# Altium schematic sheet Main_MCU.SchDoc
size B; DocumentNumber: 3; SheetNumber: 3; SheetTotal: 7
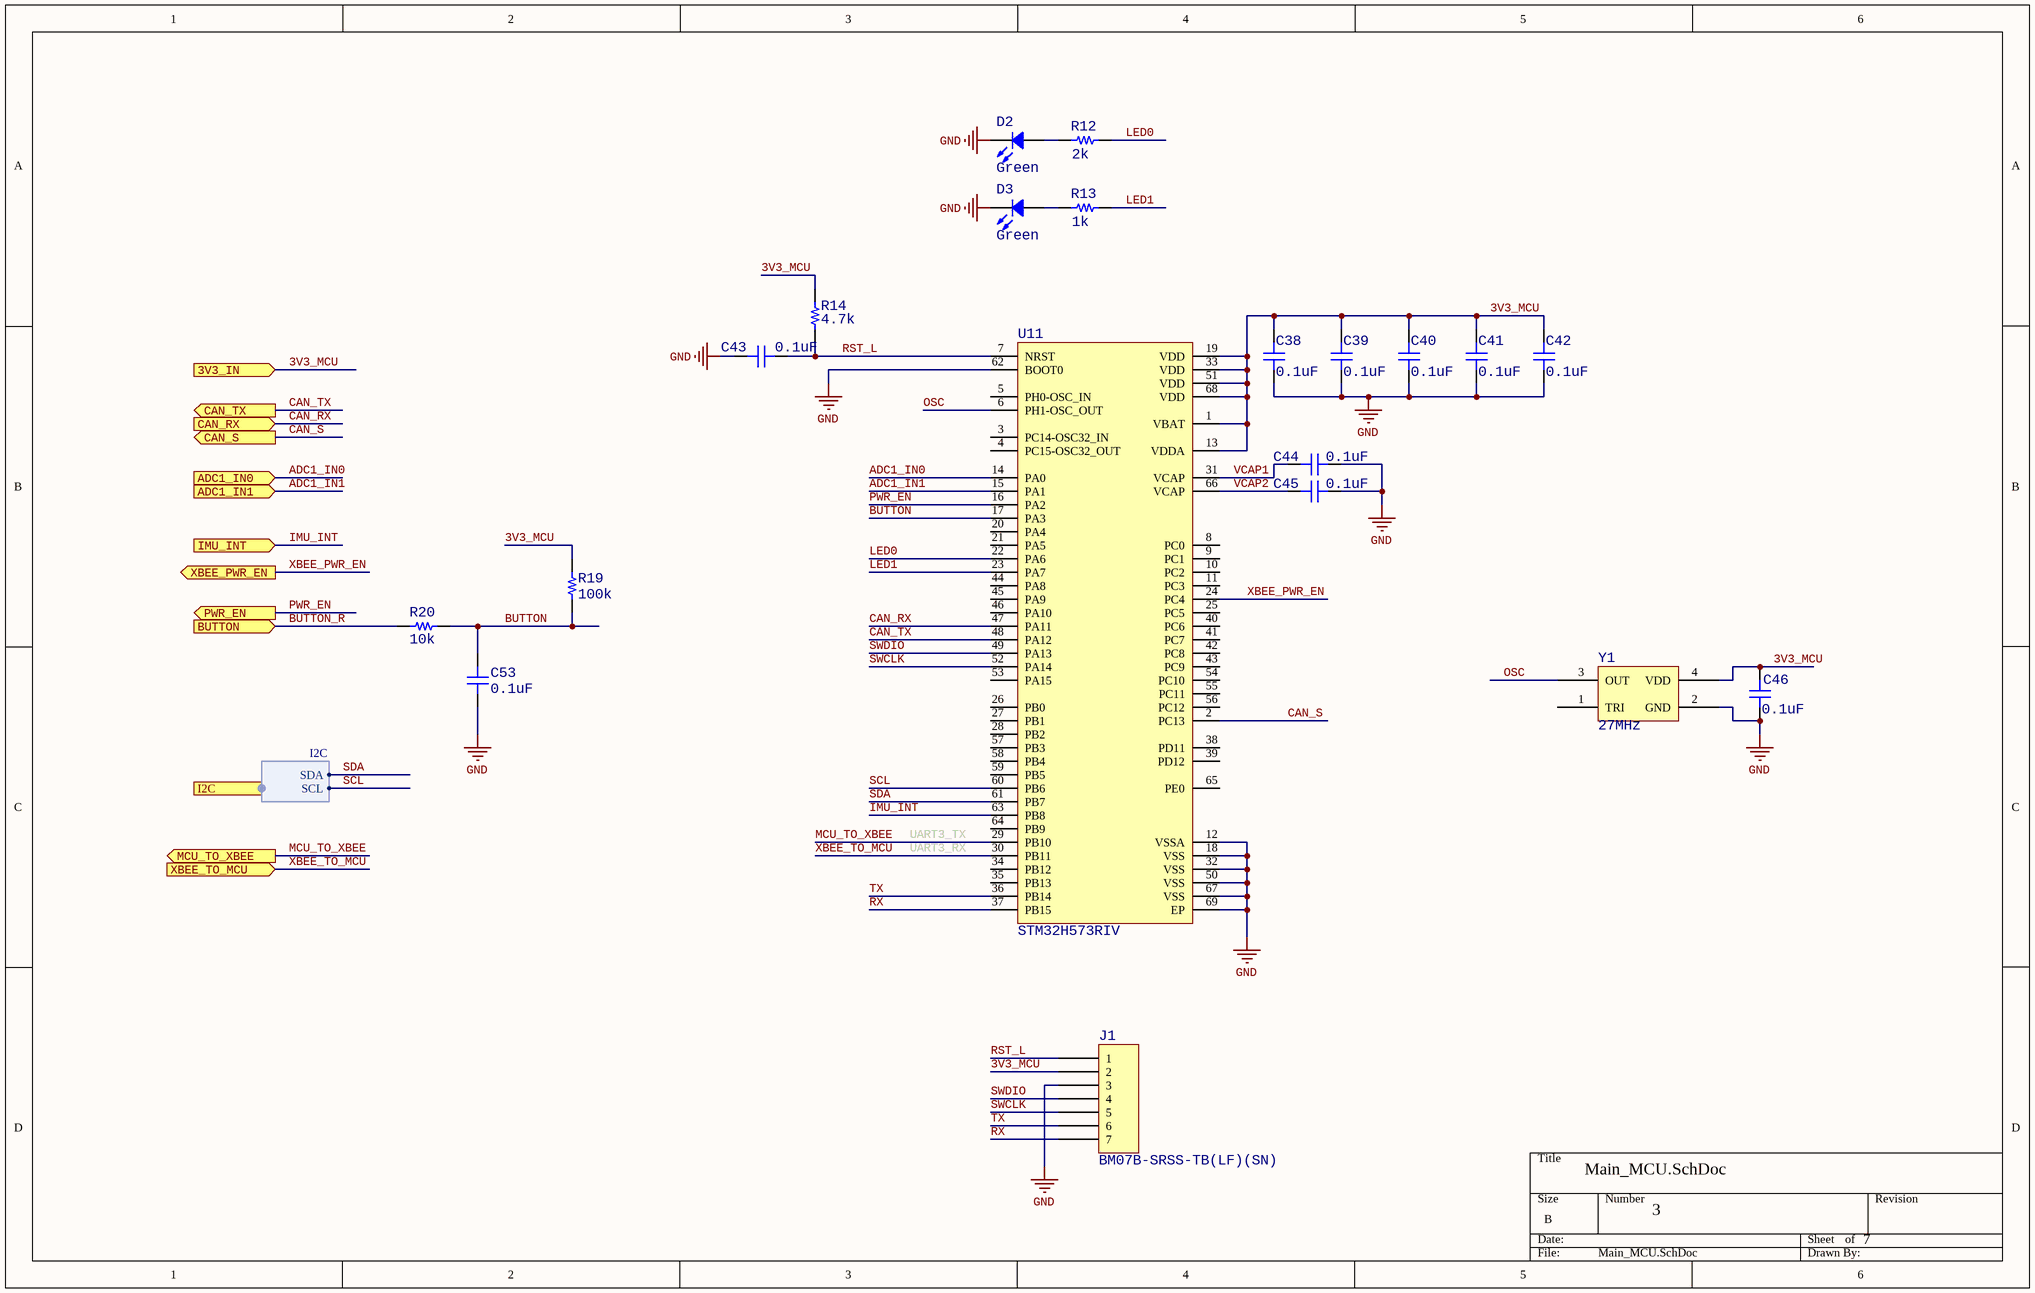
[diagram p0: Main_MCU.SchDoc]

## Parts
C38  0.1uF  [CAP_0402]
C39  0.1uF  [CAP_0402]
C40  0.1uF  [CAP_0402]
C41  0.1uF  [CAP_0402]
C42  0.1uF  [CAP_0402]
C43  0.1uF  [CAP_0402]
C44  0.1uF  [CAP_0402]
C45  0.1uF  [CAP_0402]
C46  0.1uF  [CAP_0402]
C53  0.1uF  [CAP_0402]
D2  Green  [LED 0603_1608 GREEN]
D3  Green  [LED 0603_1608 GREEN]
J1  BM07B-SRSS-TB(LF)(SN)  [JST BM07B-SRSS-TB]
R12  2k  [RES_0402]
R13  1k  [RES_0402]
R14  4.7k  [RES_0402]
R19  100k  [RES_0402]
R20  10k  [RES_0402]
U11  STM32H573RIV  [68-VFQFPN]
Y1  27MHz  [ABRACON ASD]

## Ports
3V3_IN (in), ADC1_IN0 (in), ADC1_IN1 (in), BUTTON (in), CAN_RX (in), CAN_S (out), CAN_TX (out), I2C (harness I2C), IMU_INT (in), MCU_TO_XBEE (out), PWR_EN (out), XBEE_PWR_EN (out), XBEE_TO_MCU (in)

## Harnesses
I2C: SDA, SCL

## Nets
GND: C38.1 C39.1 C40.1 C41.1 C42.1 C43.2 C44.1 C45.1 C46.1 C53.2 D2.2 D3.2 J1.3 U11.12(VSSA) U11.18(VSS) U11.32(VSS) U11.50(VSS) U11.62(BOOT0) U11.67(VSS) U11.69(EP) Y1.2(GND)
3V3_MCU: C38.2 C39.2 C40.2 C41.2 C42.2 C46.2 J1.2 R14.2 R19.1 U11.1(VBAT) U11.13(VDDA) U11.19(VDD) U11.33(VDD) U11.51(VDD) U11.68(VDD) Y1.4(VDD) ; port 3V3_IN
ADC1_IN0: U11.14(PA0) ; port ADC1_IN0
ADC1_IN1: U11.15(PA1) ; port ADC1_IN1
BUTTON: C53.1 R19.2 R20.1 U11.17(PA3)
BUTTON_R: R20.2 ; port BUTTON
CAN_RX: U11.47(PA11) ; port CAN_RX
CAN_S: U11.2(PC13) ; port CAN_S
CAN_TX: U11.48(PA12) ; port CAN_TX
IMU_INT: U11.63(PB8) ; port IMU_INT
LED0: R12.2 U11.22(PA6)
LED1: R13.2 U11.23(PA7)
MCU_TO_XBEE: U11.29(PB10) ; port MCU_TO_XBEE
OSC: U11.6(PH1-OSC_OUT) Y1.3(OUT)
PWR_EN: U11.16(PA2) ; port PWR_EN
RST_L: C43.1 J1.1 R14.1 U11.7(NRST)
RX: J1.7 U11.37(PB15)
SCL: U11.60(PB6) ; port I2C.SCL
SDA: U11.61(PB7) ; port I2C.SDA
SWCLK: J1.5 U11.52(PA14)
SWDIO: J1.4 U11.49(PA13)
TX: J1.6 U11.36(PB14)
VCAP1: C44.2 U11.31(VCAP)
VCAP2: C45.2 U11.66(VCAP)
XBEE_PWR_EN: U11.24(PC4) ; port XBEE_PWR_EN
XBEE_TO_MCU: U11.30(PB11) ; port XBEE_TO_MCU
NetD2_1: D2.1 R12.1
NetD3_1: D3.1 R13.1

Not connected (* = marked no-connect by the designer): U11 3(PC14-OSC32_IN) 4(PC15-OSC32_OUT) 5(PH0-OSC_IN) 8(PC0) 9(PC1) 10(PC2) 11(PC3) 20(PA4) 21(PA5) 25(PC5) 26(PB0) 27(PB1) 28(PB2) 34(PB12) 35(PB13) 38(PD11) 39(PD12) 40(PC6) 41(PC7) 42(PC8) 43(PC9) 44(PA8) 45(PA9) 46(PA10) 53(PA15) 54(PC10) 55(PC11) 56(PC12) 57(PB3) 58(PB4) 59(PB5) 64(PB9) 65(PE0); Y1 1(TRI)

## Notes on the sheet
- UART3_TX
- UART3_RX

## Library data of the parts
C38-C46 C53 = CAP_0402: CAP CER 402; Value: 0.1uF
D2 D3 = XZCDGK53W-8VF: LED GREEN CLEAR 2SMD; Manufacturer: SunLED; Configuration: Independent; Current - Test: 2mA; Lens Color: Colorless; Lens Size: 0.35mm Dia; Lens Style: Round with Domed Top; Millicandela Rating: 417mcd; Viewing Angle: 60°; Voltage - Forward (Vf) (Typ): 2.65V; Wavelength - Dominant: 525nm; Wavelength - Peak: 515nm; Part Number: XZCDGK53W-8VF; Color: Green; ComponentLink1Description: Datasheet; ComponentLink1URL: https://www.sunledusa.com/products/spec/XZCDGK53W-8VF.pdf; ComponentLink2Description: DigiKey Link; ComponentLink2URL: https://www.digikey.com/en/products/detail/sunled/XZCDGK53W-8VF/10449775; Device Package: 0603 (1608 Metric); Height (Max): 1.10mm; LastUpdated: 6/3/2024 7:58:52 PM; Lens Transparency: Clear; Lifecycle Status: Active; Minimum Order: 1; Mounting Type: Surface Mount; Package / Case: 0603 (1608 Metric); Packaging: TapeAndReel; PartId: 938; Part Status: Active; Price: 0.15; Series: Ultra Low Current; Size / Dimension: 1.60mm L x 0.80mm W; Supplier 1: DigiKey; Supplier Part Number 1: 1497-XZCDGK53W-8VFCT-ND; Supplier Device Package: 2-SMD; Value: Green
J1 = BM07B-SRSS-TB(LF)(SN): CONN HEADER SMD 7POS 1MM; Manufacturer: JST Sales America Inc.; Current Rating (Amps): 0.7A; Material Flammability Rating: UL94 V-0; Number of Positions: 7; Number of Positions Loaded: All; Pitch - Mating: 0.039" (1.00mm); Shrouding: Shrouded - 4 Wall; Style: Board to Cable/Wire; Voltage Rating: 50V; Part Number: BM07B-SRSS-TB(LF)(SN); ComponentLink1Description: Datasheet; ComponentLink1URL: http://www.jst-mfg.com/product/pdf/eng/eSH.pdf; ComponentLink2Description: DigiKey Link; ComponentLink2URL: http://digikey.com/product-detail/en/jst-sales-america-inc/BM07B-SRSS-TB-LF-SN/455-1793-1-ND/926864; Connector Type: Header; Contact Finish - Mating: Tin; Contact Finish - Post: Tin; Contact Material: Copper Alloy; Contact Shape: Square; Contact Type: Male Pin; Fastening Type: Push-Pull; Features: Solder Retention; Insulation Color: Natural; Insulation Height: 0.167" (4.25mm); Insulation Material: Polyamide (PA), Nylon; LastUpdated: 1/12/2020 10:15:04 PM; Lifecycle Status: Active; Minimum Order: 1; Mounting Type: Surface Mount; Number of Rows: 1; Operating Temperature: -25°C ~ 85°C; Packaging: TapeAndReel; PartId: 22; Part Status: Active; Price: 0.42; Series: SR; Supplier 1: DigiKey; Supplier Part Number 1: 455-1793-1-ND; Termination: Solder
R12-R14 R19 R20 = RES_0402: RES 0402
Y1 = ASD3-27.000MHZ-EC-T: XTAL OSC XO 27.0000MHZ HCMOS SMD; Manufacturer: Abracon LLC; Base Resonator: Crystal; Current - Supply (Max): 4mA; Frequency Stability: ±50ppm; Function: Enable/Disable; Voltage - Supply: 1.8V; Part Number: ASD3-27.000MHZ-EC-T; ComponentLink1Description: Datasheet; ComponentLink1URL: https://abracon.com/Oscillators/ASDseries.pdf; ComponentLink2Description: DigiKey Link; ComponentLink2URL: http://digikey.com/product-detail/en/abracon-llc/ASD3-27.000MHZ-EC-T/535-9608-1-ND/1237075; Frequency: 27MHz; Height - Seated (Max): 0.039" (1.00mm); LastUpdated: 6/3/2024 8:02:05 PM; Lifecycle Status: Active; Minimum Order: 1; Mounting Type: Surface Mount; Operating Temperature: -20°C ~ 70°C; Output: HCMOS; Package / Case: 4-SMD, No Lead; Packaging: TapeAndReel; PartId: 4; Part Status: Active; Price: 1.74; Series: ASD; Size / Dimension: 0.098" L x 0.079" W (2.50mm x 2.00mm); Supplier 1: DigiKey; Supplier Part Number 1: 535-9608-1-ND; Type: XO (Standard); Value: 27MHz